# EAGLE schematic udos_hutschiene (EAGLE 5.11)
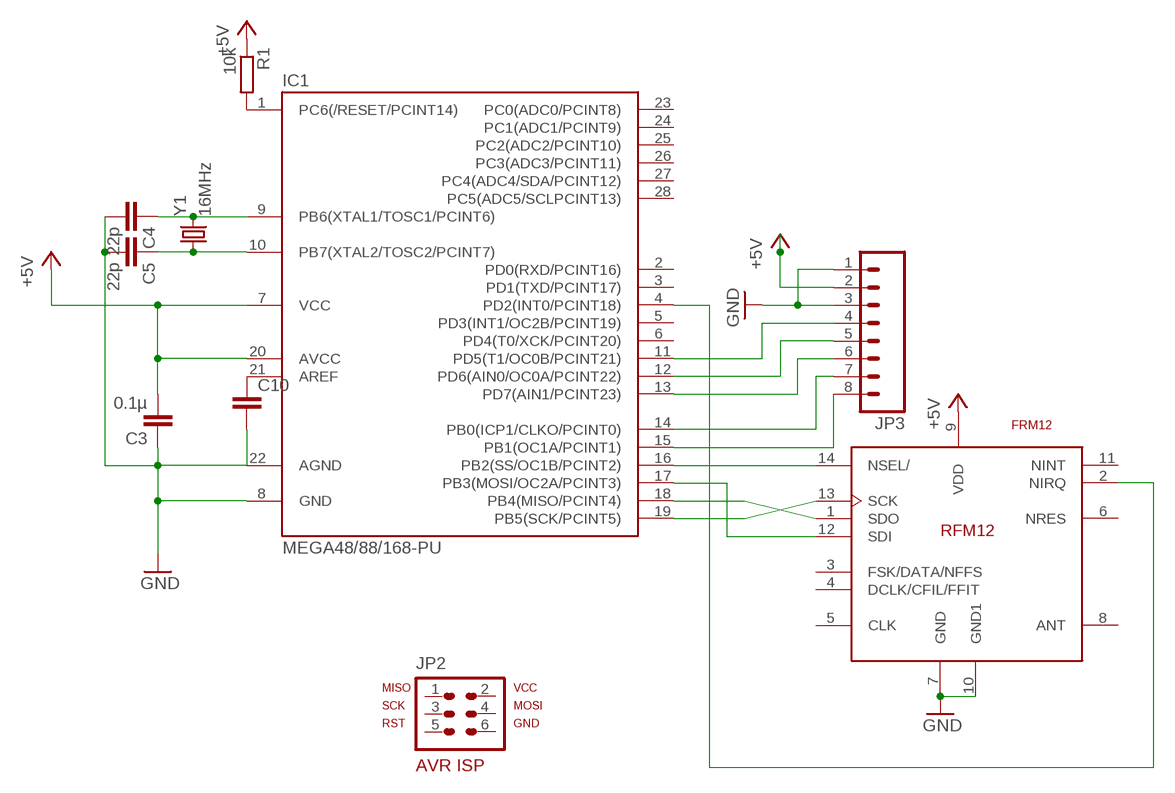
[diagram p0: schematic, sheet 1]

## Parts
C3  0.1µ  CAPPTH  [CAP-PTH-SMALL]
C4  22p  CAPPTH  [CAP-PTH-SMALL]
C5  22p  CAPPTH  [CAP-PTH-SMALL]
C10  CAPPTH  [CAP-PTH-SMALL]
IC1  MEGA48/88/168-PU  [DIL28-3]
JP2  AVR-ISP-6VERT  [AVR-ISP-6]
JP3  M08LOCK_LONGPADS  [1X08_LOCK_LONGPADS]
R1  10k  R-EU_0207/7  [0207/7]
U$1  FRM12  [RFM12]
Y1  16MHz  CRYSTALHC49US  [HC49US]

## Nets
+5V: C3.2 IC1.7(VCC) IC1.20(AVCC) JP3.2 R1.1 U$1.9(VDD)
GND: C3.1 C4.2 C5.2 C10.2 IC1.8(GND) IC1.22(AGND) JP3.1 JP3.3 U$1.7(GND) U$1.10(GND1)
MOSI: IC1.17(PB3(MOSI/OC2A/PCINT3)) U$1.12(SDI)
N$1: IC1.19(PB5(SCK/PCINT5)) U$1.13(SCK)
N$2: IC1.18(PB4(MISO/PCINT4)) U$1.1(SDO)
N$3: IC1.15(PB1(OC1A/PCINT1)) JP3.8
N$4: IC1.16(PB2(SS/OC1B/PCINT2)) U$1.14(NSEL/)
N$5: IC1.14(PB0(ICP1/CLKO/PCINT0)) JP3.7
N$6: C5.1 IC1.10(PB7(XTAL2/TOSC2/PCINT7)) Y1.1
N$7: C4.1 IC1.9(PB6(XTAL1/TOSC1/PCINT6)) Y1.2
N$8: IC1.13(PD7(AIN1/PCINT23)) JP3.6
N$9: IC1.12(PD6(AIN0/OC0A/PCINT22)) JP3.5
N$10: IC1.11(PD5(T1/OC0B/PCINT21)) JP3.4
N$23: C10.1 IC1.21(AREF)
NIRQ: IC1.4(PD2(INT0/PCINT18)) U$1.2(NIRQ)
RESET: IC1.1(PC6(/RESET/PCINT14)) R1.2
Unconnected: IC1.2(PD0(RXD/PCINT16)) IC1.3(PD1(TXD/PCINT17)) IC1.5(PD3(INT1/OC2B/PCINT19)) IC1.6(PD4(T0/XCK/PCINT20)) IC1.23(PC0(ADC0/PCINT8)) IC1.24(PC1(ADC1/PCINT9)) IC1.25(PC2(ADC2/PCINT10)) IC1.26(PC3(ADC3/PCINT11)) IC1.27(PC4(ADC4/SDA/PCINT12)) IC1.28(PC5(ADC5/SCLPCINT13)) JP2.1 JP2.2 JP2.3 JP2.4 JP2.5 JP2.6 U$1.3(FSK/DATA/NFFS) U$1.4(DCLK/CFIL/FFIT) U$1.5(CLK) U$1.6(NRES) U$1.8(ANT) U$1.11(NINT)

## Library data of the parts
C3-C5 C10 = SparkFun:CAP: Capacitor Standard 0603 ceramic capacitor, and 0.1" leaded capacitor.
IC1 = avr-7:MEGA48/88/168-PU
JP2 = avr-7:AVR-ISP-6: AVR ISP-6 Serial Programming Header
JP3 = SparkFun:M08: Header 8 Standard 8-pin 0.1" header. Use with straight break away headers (SKU : PRT-00116), right angle break away headers (PRT-00553), swiss pins (PRT-00743), machine pins (PRT-00117), and female headers (PRT-00115).
R1 = rcl:R-EU_: RESISTOR, European symbol
U$1 = RFM12:FRM12
Y1 = SparkFun:CRYSTAL: Crystals Various standard crystals. Proven footprints. Spark Fun Electronics SKU : COM-00534